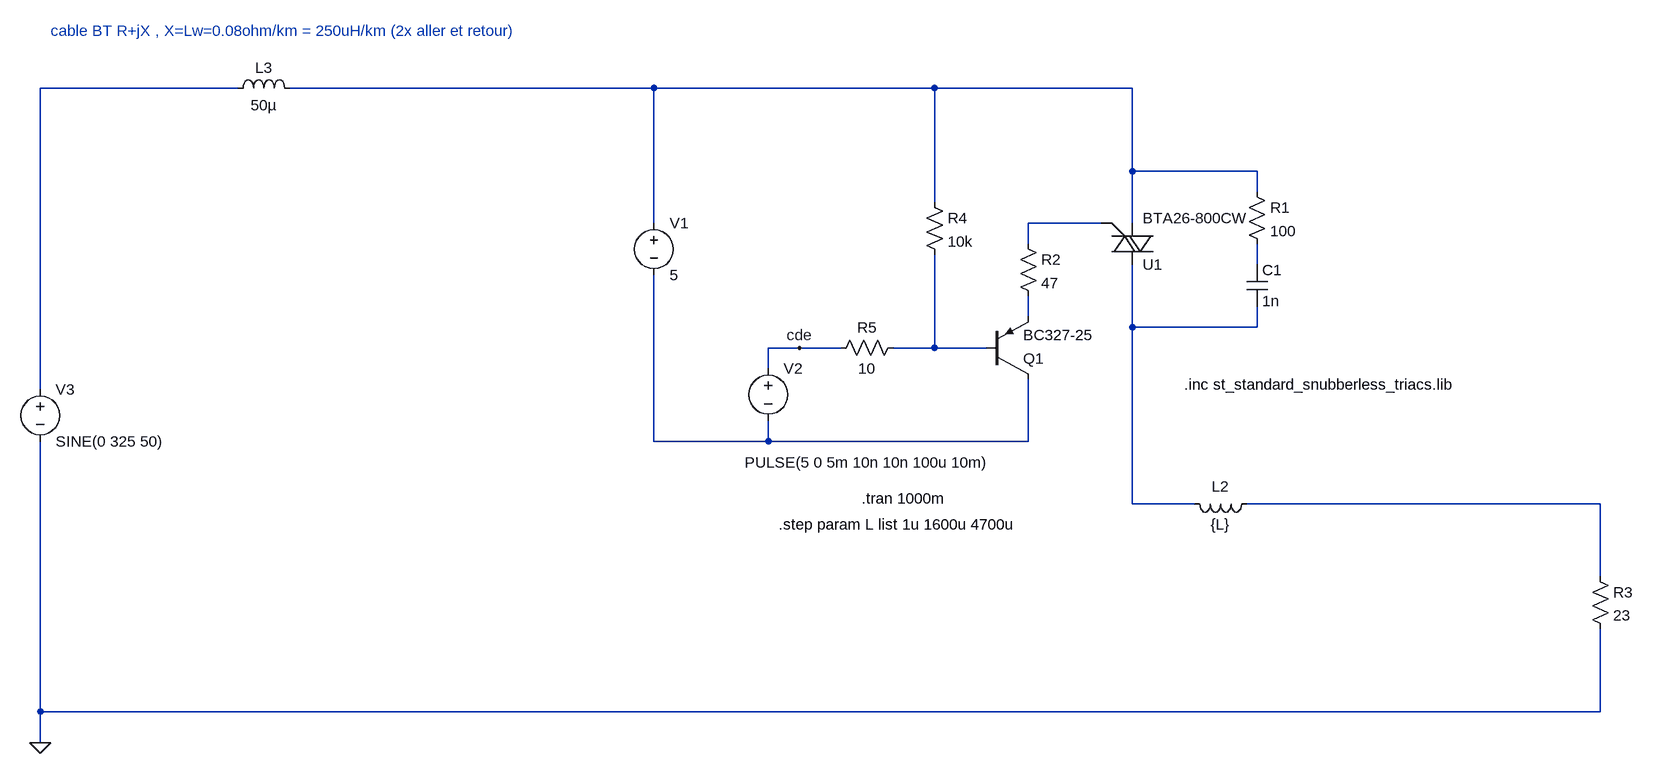
[diagram p0: schematic triac23_filter.asc]
triac23_filter.asc, the LTspice schematic file:
Version 4
SHEET 1 1340 756
WIRE -816 -288 -1120 -288
WIRE -176 -288 -736 -288
WIRE 256 -288 -176 -288
WIRE 560 -288 256 -288
WIRE 560 -160 560 -288
WIRE 752 -160 560 -160
WIRE 752 -128 752 -160
WIRE 256 -112 256 -288
WIRE -176 -80 -176 -288
WIRE 512 -80 400 -80
WIRE 560 -80 560 -160
WIRE 400 -48 400 -80
WIRE 752 -16 752 -48
WIRE 400 64 400 32
WIRE 560 80 560 -16
WIRE 752 80 752 48
WIRE 752 80 560 80
WIRE 48 112 0 112
WIRE 112 112 48 112
WIRE 256 112 256 -32
WIRE 256 112 192 112
WIRE 336 112 256 112
WIRE 0 144 0 112
WIRE -1120 176 -1120 -288
WIRE -176 256 -176 0
WIRE 0 256 0 224
WIRE 0 256 -176 256
WIRE 400 256 400 160
WIRE 400 256 0 256
WIRE 560 352 560 80
WIRE 656 352 560 352
WIRE 1280 352 736 352
WIRE 1280 464 1280 352
WIRE -1120 672 -1120 256
WIRE 1280 672 1280 544
WIRE 1280 672 -1120 672
WIRE -1120 720 -1120 672
FLAG 48 112 cde
FLAG -1120 720 0
SYMBOL voltage -176 -96 R0
WINDOW 123 0 0 Left 0
WINDOW 39 0 0 Left 0
SYMATTR InstName V1
SYMATTR Value 5
SYMBOL voltage 0 128 R0
WINDOW 3 -36 160 Left 2
WINDOW 123 0 0 Left 0
WINDOW 39 0 0 Left 0
SYMATTR Value PULSE(5 0 5m 10n 10n 100u 10m)
SYMATTR InstName V2
SYMBOL res 736 -144 R0
SYMATTR InstName R1
SYMATTR Value 100
SYMBOL cap 736 -16 R0
SYMATTR InstName C1
SYMATTR Value 1n
SYMBOL res 384 -64 R0
SYMATTR InstName R2
SYMATTR Value 47
SYMBOL pnp 336 160 M180
SYMATTR InstName Q1
SYMATTR Value BC327-25
SYMBOL res 240 -128 R0
SYMATTR InstName R4
SYMATTR Value 10k
SYMBOL voltage -1120 160 R0
WINDOW 123 0 0 Left 0
WINDOW 39 0 0 Left 0
SYMATTR InstName V3
SYMATTR Value SINE(0 325 50)
SYMBOL res 1264 448 R0
SYMATTR InstName R3
SYMATTR Value 23
SYMBOL TRIAC_ST_AKG 528 -16 M180
SYMATTR InstName U1
SYMATTR Value BTA26-800CW
SYMBOL res 208 96 R90
WINDOW 0 0 56 VBottom 2
WINDOW 3 32 56 VTop 2
SYMATTR InstName R5
SYMATTR Value 10
SYMBOL ind 752 336 R90
WINDOW 0 5 56 VBottom 2
WINDOW 3 32 56 VTop 2
SYMATTR InstName L2
SYMATTR Value {L}
SYMBOL ind -832 -272 R270
WINDOW 0 32 56 VTop 2
WINDOW 3 5 56 VBottom 2
SYMATTR InstName L3
SYMATTR Value 50µ
SYMATTR SpiceLine Rser=10m
TEXT 640 168 Left 2 !.inc st_standard_snubberless_triacs.lib
TEXT 144 344 Left 2 !.tran 1000m
TEXT -1104 -376 Left 2 ;cable BT R+jX , X=Lw=0.08ohm/km = 250uH/km (2x aller et retour)
TEXT 16 384 Left 2 !.step param L list 1u 1600u 4700u

The netlist it stands for:
* triac23_filter.asc
V1 N002 N008 5
V2 cde N008 PULSE(5 0 5m 10n 10n 100u 10m)
R1 N002 N004 100
C1 N004 N006 1n
R2 N003 N005 47
Q1 N008 N007 N005 0 BC327-25
R4 N002 N007 10k
V3 N001 0 SINE(0 325 50)
R3 N009 0 23
XU1 N006 N002 N003 BTA26-800CW  ; pins A K G
R5 N007 cde 10
L2 N009 N006 {L}
L3 N001 N002 50µ Rser=10m
.model NPN NPN
.model PNP PNP
.lib standard.bjt
.inc st_standard_snubberless_triacs.lib
.tran 1000m
* cable BT R+jX , X=Lw=0.08ohm/km = 250uH/km (2x aller et retour)
.step param L list 1u 1600u 4700u
.backanno
.end